# EAGLE design hub (EAGLE 6.6.0)
CNAME: Aurai; CREVISION: 1; DESIGNER: Thomas Rix
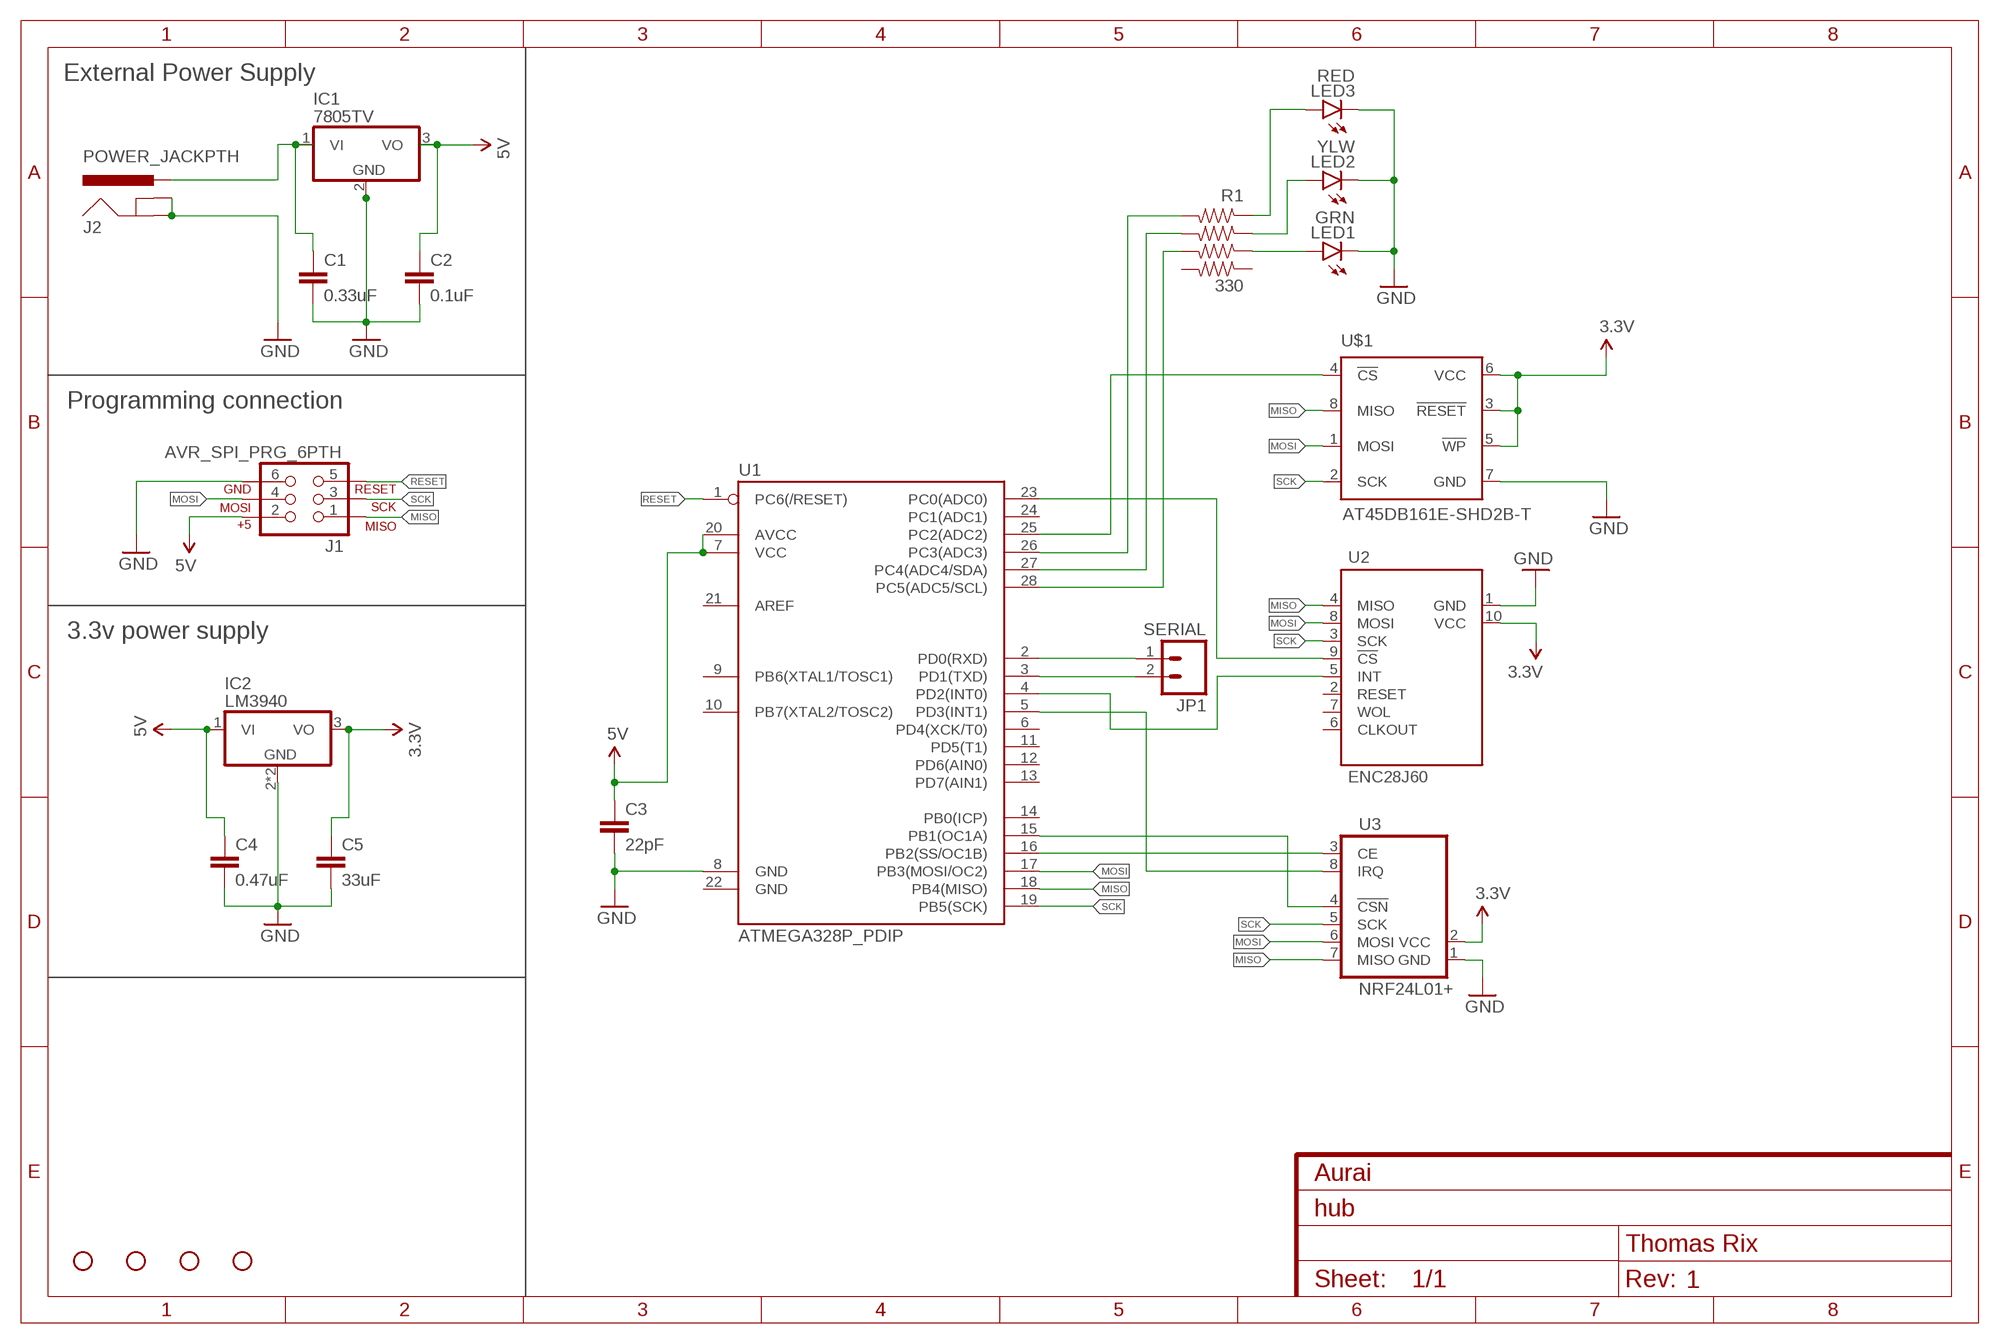
[diagram p0: schematic, sheet 1]

## Parts
C1  0.33uF  CAP0805  [0805]
C2  0.1uF  CAP0805  [0805]
C3  22pF  CAP0805  [0805]
C4  0.47uF  CAP0805  [0805]
C5  33uF  CAP0805  [0805]
IC1  7805TV  [TO220V]
IC2  LM3940  [SOT223]
J1  AVR_SPI_PRG_6PTH  [2X3]
J2  POWER_JACKPTH  [POWER_JACK_PTH]
JP1  SERIAL  M02PTH  [1X02]
LED1  GRN  LED1206  [LED-1206]
LED2  YLW  LED1206  [LED-1206]
LED3  RED  LED1206  [LED-1206]
R1  330  CRA06ES08  [CRA06S08]
STANDOFF1  STAND-OFF  [STAND-OFF]
STANDOFF2  STAND-OFF  [STAND-OFF]
STANDOFF3  STAND-OFF  [STAND-OFF]
STANDOFF4  STAND-OFF  [STAND-OFF]
U1  ATMEGA328P_PDIP  [DIL28-3]
U2  ENC28J60  [ENC28J60_HEADER]
U3  NRF24L01+  [NRF24L01_HEADER]
U$1  AT45DB161E-SHD2B-T  [SO08-EIAJ]

## Nets
3.3V: C5.1 IC2.3(VO) U2.10(VCC) U3.2(VCC) U$1.3(!RESET) U$1.5(!WP) U$1.6(VCC)
5V: C2.1 C3.1 C4.1 IC1.3(VO) IC2.1(VI) J1.2 U1.7(VCC) U1.20(AVCC)
GND: C1.2 C2.2 C3.2 C4.2 C5.2 IC1.2(GND) IC2.2(GND) IC2.4(GND) J1.6 J2.GND J2.GNDBREAK LED1.C LED2.C LED3.C U1.8(GND) U2.1(GND) U3.1(GND) U$1.7(GND)
MISO: J1.1 U1.18(PB4(MISO)) U2.4(MISO) U3.7(MISO) U$1.8(MISO)
MOSI: J1.4 U1.17(PB3(MOSI/OC2)) U2.8(MOSI) U3.6(MOSI) U$1.1(MOSI)
N$1: LED1.A R1.3(R3A)
N$2: JP1.1 U1.2(PD0(RXD))
N$3: R1.7(R2B) U1.27(PC4(ADC4/SDA))
N$4: JP1.2 U1.3(PD1(TXD))
N$5: R1.8(R1B) U1.26(PC3(ADC3))
N$6: LED3.A R1.1(R1A)
N$7: U1.15(PB1(OC1A)) U3.4(!CSN)
N$8: LED2.A R1.2(R2A)
N$9: U1.16(PB2(SS/OC1B)) U3.3(CE)
N$10: U1.5(PD3(INT1)) U3.8(IRQ)
N$11: U1.25(PC2(ADC2)) U$1.4(!CS)
N$12: R1.6(R3B) U1.28(PC5(ADC5/SCL))
N$13: U1.23(PC0(ADC0)) U2.9(!CS)
N$14: C1.1 IC1.1(VI) J2.PWR
N$15: U1.4(PD2(INT0)) U2.5(INT)
RESET: J1.5 U1.1(PC6(/RESET))
SCK: J1.3 U1.19(PB5(SCK)) U2.3(SCK) U3.5(SCK) U$1.2(SCK)
Unconnected: R1.4(R4A) R1.5(R4B) U1.6(PD4(XCK/T0)) U1.9(PB6(XTAL1/TOSC1)) U1.10(PB7(XTAL2/TOSC2)) U1.11(PD5(T1)) U1.12(PD6(AIN0)) U1.13(PD7(AIN1)) U1.14(PB0(ICP)) U1.21(AREF) U1.22(GND) U1.24(PC1(ADC1)) U2.2(RESET) U2.6(CLKOUT) U2.7(WOL)

## Notes on the sheet
- External Power Supply
- Programming connection
- 3.3v power supply

## Library data of the parts
C1 C2 C4 C5 = SparkFun-Capacitors:CAP: Capacitor Standard 0603 ceramic capacitor, and 0.1" leaded capacitor.
C3 = SparkFun-Passives:CAP: Capacitor Standard 0603 ceramic capacitor, and 0.1" leaded capacitor.
IC1 = linear:78*: Positive VOLTAGE REGULATOR Source: http://cache.national.com/ds/LM/LM78L05.pdf http://www.fairchildsemi.com/ds/LM/LM7805.pdf
IC2 = aurai:LM3940: LM3904 5v to 3.3v LDO
J1 = SparkFun-Connectors:AVR_SPI_PRG_6: AVR ISP 6 Pin This is the reduced ISP connector for AVR programming. Common on Arduino. This footprint will take up less PCB space and can be used with a 10-pin to 6-pin adapter such as SKU: BOB-08508 **Special note about "TEST_POINT" package. The stop mask is on the top side, so if you want your programming test points to be on the bottom of your board, make sure to place this package on the bottom side of the board. This also ensure that the orientation to program from the bottom side will be correct.
J2 = SparkFun-Connectors:POWER_JACK: Power Jack This is the standard 5.5mm barrel jack for power. The PTH is the most common, proven, reliable, footprint. The Slot footprint only works if the mill layer is transmitted to the PCB fab house so be warned. Mating wall wart : TOL-00298 (and others); PROD_ID: PRT-00119
JP1 = SparkFun-Connectors:M02: Standard 2-pin 0.1" header. Use with - straight break away headers ( PRT-00116) - right angle break away headers (PRT-00553) - swiss pins (PRT-00743) - machine pins (PRT-00117) - female headers (PRT-00115) Molex polarized connector foot print use with: PRT-08233 with associated crimp pins and housings. 2.54_SCREWTERM for use with PRT-10571. 3.5mm Screw Terminal footprints for PRT-08084 5mm Screw Terminal footprints for use with PRT-08433
LED1-LED3 = SparkFun-LED:LED: LEDs Standard schematic elements and footprints for 5mm, 3mm, 1206, and 0603 sized LEDs. 5mm - Spark Fun Electronics SKU : COM-00529 (and others)
R1 = aurai:CRA06ES08
STANDOFF1-STANDOFF4 = SparkFun-Electromechanical:STAND-OFF: #4 Stand Off This is the mechanical footprint for a #4 phillips button head screw. Use the keepout ring to avoid running the screw head into surrounding components. SKU : PRT-00447
U1 = SparkFun-DigitalIC:ATMEGA328P_PDIP: uC used in the Arduino 32kb flash, 1k EEPROM, 2k SRAM This is the through-hole version of this chip.
U2 = aurai:ENC28J60
U3 = aurai:NRF24L01+
U$1 = aurai:AT45DB161E; PRT_MSR: 556-AT45DB161ESHD2BT

## Board
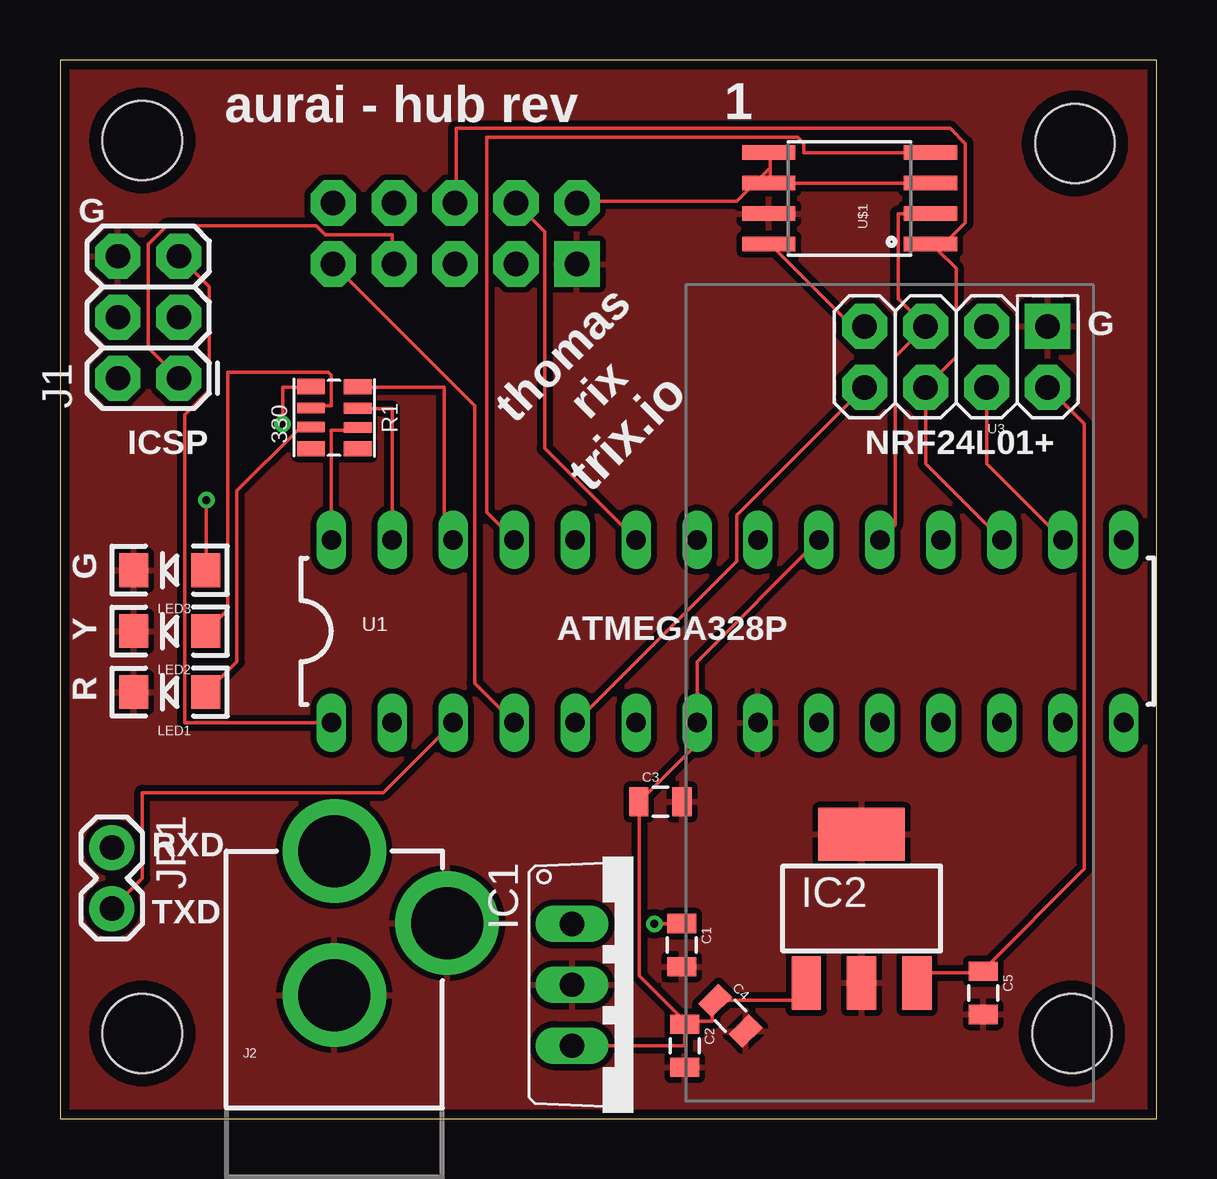
[diagram p1: board, top side]
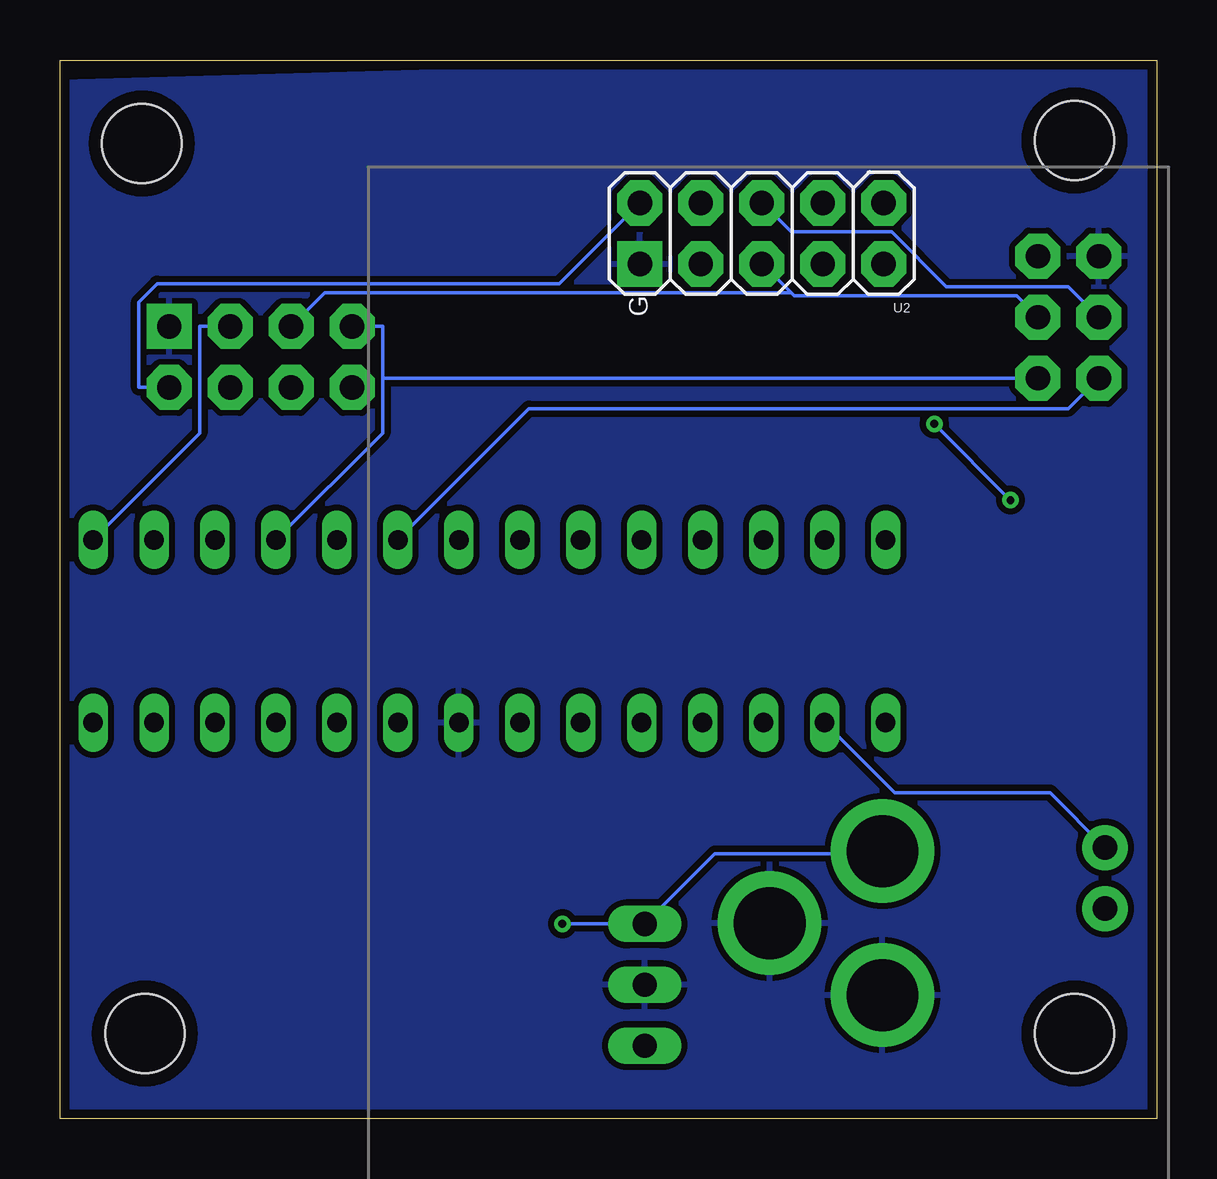
[diagram p2: board, bottom side, seen from below]

Size 45.7 x 44.12 mm. Coordinates in mm from the lower left corner, seen from the top.
Outline: 0,0 45.7,0 45.7,44.12 0,44.12 0,0
Copper layers (1*16): Top 0.0356mm / dielectric 1.5011mm / Bottom 0.0356mm
Design rules "LaenPCBOrder": minimum track width 6mil, minimum drill 13mil, track to track 6mil, track to pad 6mil, pad to pad 6mil, via to via 6mil, smd to smd 6mil, copper to edge 15mil, drill to drill 6mil, minimum pad ring 7mil, minimum via ring 7mil, stop-mask expansion 3mil, vias tented up to drill 0mil, thermal gap 10mil

### Footprints (pad centres in the part's own frame; a part is rotated, then mirrored left to right if it is on the bottom)
0805 = smd 0.8 x 1.2: 1 -0.9,0; 2 0.9,0
TO220V = drill 1.016 long: 1 -2.54,-2.54; 2 0,-2.54; 3 2.54,-2.54
SOT223 = smd 1.219 x 2.235: 1 -2.311,-3.099; 2 0,-3.099; 3 2.311,-3.099 | smd 3.6 x 2.2: 4 0,3.099
2X3 = drill 1.016 pad 1.88 octagon: 1 0,0; 2 0,2.54; 3 2.54,0; 4 2.54,2.54; 5 5.08,0; 6 5.08,2.54
POWER_JACK_PTH = drill 2.997 pad 4.318: GND 0,7.7; GNDBREAK 4.7,10.7; PWR 0,13.7
1X02 = drill 1.016 pad 1.88: 1 0,0; 2 2.54,0
LED-1206 = smd 1.2 x 1.4: A -1.5,0; C 1.5,0
CRA06S08 = smd 0.63 x 1.15: 1 -1.305,-0.98; 4 1.285,-0.98; 5 1.295,0.975; 8 -1.295,0.975 | smd 0.44 x 1.15: 2 -0.41,-0.98; 3 0.39,-0.98; 6 0.4,0.975; 7 -0.4,0.975
STAND-OFF = hole 3.302: 0,0
DIL28-3 = drill 0.813 long: 1 -16.51,-3.81; 2 -13.97,-3.81; 3 -11.43,-3.81; 4 -8.89,-3.81; 5 -6.35,-3.81; 6 -3.81,-3.81; 7 -1.27,-3.81; 8 1.27,-3.81; 9 3.81,-3.81; 10 6.35,-3.81; 11 8.89,-3.81; 12 11.43,-3.81; 13 13.97,-3.81; 14 16.51,-3.81; 15 16.51,3.81; 16 13.97,3.81; 17 11.43,3.81; 18 8.89,3.81; 19 6.35,3.81; 20 3.81,3.81; 21 1.27,3.81; 22 -1.27,3.81; 23 -3.81,3.81; 24 -6.35,3.81; 25 -8.89,3.81; 26 -11.43,3.81; 27 -13.97,3.81; 28 -16.51,3.81
ENC28J60_HEADER = drill 1.016 pad 1.88 square: 1 -1.21,5.03 | drill 1.016 pad 1.88 octagon: 2 -1.21,2.49; 3 -1.21,-0.05; 4 -1.21,-2.59; 5 -1.21,-5.13; 6 1.33,-5.13; 7 1.33,-2.59; 8 1.33,-0.05; 9 1.33,2.49; 10 1.33,5.03
NRF24L01_HEADER = drill 1.016 pad 1.88 square: 1 1.27,-5.08 | drill 1.016 pad 1.88 octagon: 2 -1.27,-5.08; 3 -1.27,-2.54; 4 1.27,-2.54; 5 1.27,0; 6 -1.27,0; 7 1.27,2.54; 8 -1.27,2.54
SO08-EIAJ = smd 0.61 x 2.21: 1 -1.905,-3.378; 2 -0.635,-3.378; 3 0.635,-3.378; 4 1.905,-3.378; 5 1.905,3.353; 6 0.635,3.353; 7 -0.635,3.353; 8 -1.905,3.353

### Placement (x,y rotation side)
C1  25.91,7.24 270 top
C2  26.04,3.05 270 top
C3  25.02,13.21 0 top
C4  27.93,4.3 315 top
C5  38.47,5.25 270 top
IC1  23.88,5.59 270 top
IC2  33.4,8.76 0 top
J1  4.95,30.86 90 top
J2  11.43,-2.54 0 top
JP1  2.16,11.3 270 top
LED1  4.57,17.78 180 top
LED2  4.57,20.32 180 top
LED3  4.57,22.86 180 top
R1  11.43,29.21 270 top
STANDOFF1  3.43,3.56 0 top
STANDOFF2  42.16,3.56 0 top
STANDOFF3  3.43,40.77 0 top
STANDOFF4  42.29,40.64 0 top
U1  27.81,20.32 0 top
U2  16.51,36.83 90 bottom
U3  36.07,31.75 90 top
U$1  32.89,38.35 90 top

### Tracks (layer width: path | path; a pad name or v marks a point on that pad's centre or on a via)
3.3V
  Top 0.152: 29.59,39.62 29.59,40.26 U$1.5 | 29.59,39.62 29.59,38.99 | 29.59,38.99 U$1.3 | 29.59,38.99 U$1.6 | 29.59,39.62 28.19,38.23 21.59,38.23 U2.10 | IC2.3 35.81,5.71 35.81,6.1 38.35,6.1 C5.1 38.48,6.22 42.67,10.41 42.67,28.96 U3.2
  Bottom 0.152: U3.2 42.42,30.48 42.42,34.04 41.66,34.8 24.89,34.8 21.59,38.1 U2.10
5V
  Top 0.152: 26.04,4.06 27.18,4.06 27.18,4.83 C4.1 27.3,4.95 30.99,4.95 30.99,5.59 IC2.1 | IC1.3 26.04,3.05 C2.1 26.04,4.06 | C3.1 26.54,15.62 U1.7 26.54,19.05 U1.20 | 26.04,4.06 24.13,5.97 C3.1 | C3.1
  Bottom 0.152: J1.2 3.68,29.59 26.16,29.59 U1.20
GND
  pour Bottom (isolate 0.254): 0,0 0,44.45 45.72,43.18 45.72,0
  pour Top (isolate 0.254): 0,0 0,44.45 45.72,44.45 45.72,0
MISO
  Top 0.152: J1.1 3.68,32.13 3.68,36.45 4.45,37.21 10.67,37.21 11.05,36.83 13.84,36.83 13.84,35.69 U2.4 | U3.7 33.02,33.02 29.59,36.45 U$1.8
  Bottom 0.152: U1.18 32.26,28.57 32.26,30.86 | 32.26,30.86 32.26,33.02 U3.7 | 32.26,30.86 J1.1
MOSI
  Top 0.152: 36.58,36.2 37.34,35.43 37.34,31.75 U3.6 36.07,27.3 U1.17 | 36.58,36.2 36.32,36.45 U$1.1 36.58,36.2 | 36.58,36.2 37.72,37.34 37.72,40.64 37.08,41.27 16.51,41.27 16.51,38.23 U2.8
  Bottom 0.152: J1.4 3.68,34.67 8.76,34.67 11.05,36.96 15.24,36.96 16.38,38.1 U2.8
N$1
  Top 0.152: R1.3 10.41,28.7 9.91,28.7 7.37,26.16 7.37,19.05 6.1,17.78 LED1.A
N$2
  Bottom 0.152: U1.2 10.92,13.59 4.45,13.59 JP1.1
N$3
  Top 0.152: U1.27 13.84,29.59 12.45,29.59 R1.7
N$4
  Top 0.152: U1.3 13.46,13.59 3.43,13.59 3.43,10.03 JP1.2
N$5
  Top 0.152: U1.26 16,24.51 16,30.48 12.45,30.48 R1.8
N$6  (via drill 0.33)
  Top 0.152: v9.27,28.96 9.27,30.48 10.41,30.48 R1.1 | v6.1,25.78 6.1,22.86 LED3.A
  Bottom 0.152: v6.1,25.78 v9.27,28.96
N$7
  Bottom 0.152: U1.15 39.88,28.57 39.88,33.02 U3.4
N$8
  Top 0.152: R1.2 10.54,29.72 11.3,29.72 11.3,30.99 11.18,31.11 6.99,31.11 6.99,21.21 6.1,20.32 LED2.A
N$9
  Top 0.152: U1.16 38.61,27.3 U3.3
N$10
  Top 0.152: U1.5 28.19,23.24 28.19,25.15 U3.8
N$11
  Top 0.152: U$1.4 30.99,40.26 30.99,40.64 30.73,40.89 17.78,40.89 17.78,25.27 U1.25
N$12
  Top 0.152: U1.28 11.3,28.7 12.32,28.7 R1.6
N$13
  Top 0.152: U1.23 20.19,27.94 20.19,36.96 19.05,38.1 U2.9
N$14  (via drill 0.33)
  Top 0.152: v24.77,8.13 25.91,8.13 C1.1
  Bottom 0.152: v24.77,8.13 IC1.1 18.41,11.05 11.43,11.05 J2.PWR
N$15
  Top 0.152: U1.4 17.27,18.16 17.27,29.72 11.43,35.56 U2.5
RESET
  Top 0.152: U1.1 5.21,16.51 5.21,29.34 6.22,30.35 6.22,34.67 J1.5
SCK
  Top 0.152: U$1.2 34.92,37.72 34.92,34.16 U3.5 34.8,31.75 34.8,24.77 U1.19
  Bottom 0.152: J1.3 5.84,34.29 15.11,34.29 15.24,34.42 | 15.24,34.42 16.38,35.56 U2.3 | U3.5 34.67,34.42 15.24,34.42

### Text on the board
tPlace: aurai - hub rev | G | G | thomas / rix | ICSP | NRF24L01+ | trix.io | G | Y | ATMEGA328P | R | RXD | TXD